# Altium schematic sheet CasinoLEDScheme.SchDoc
size B
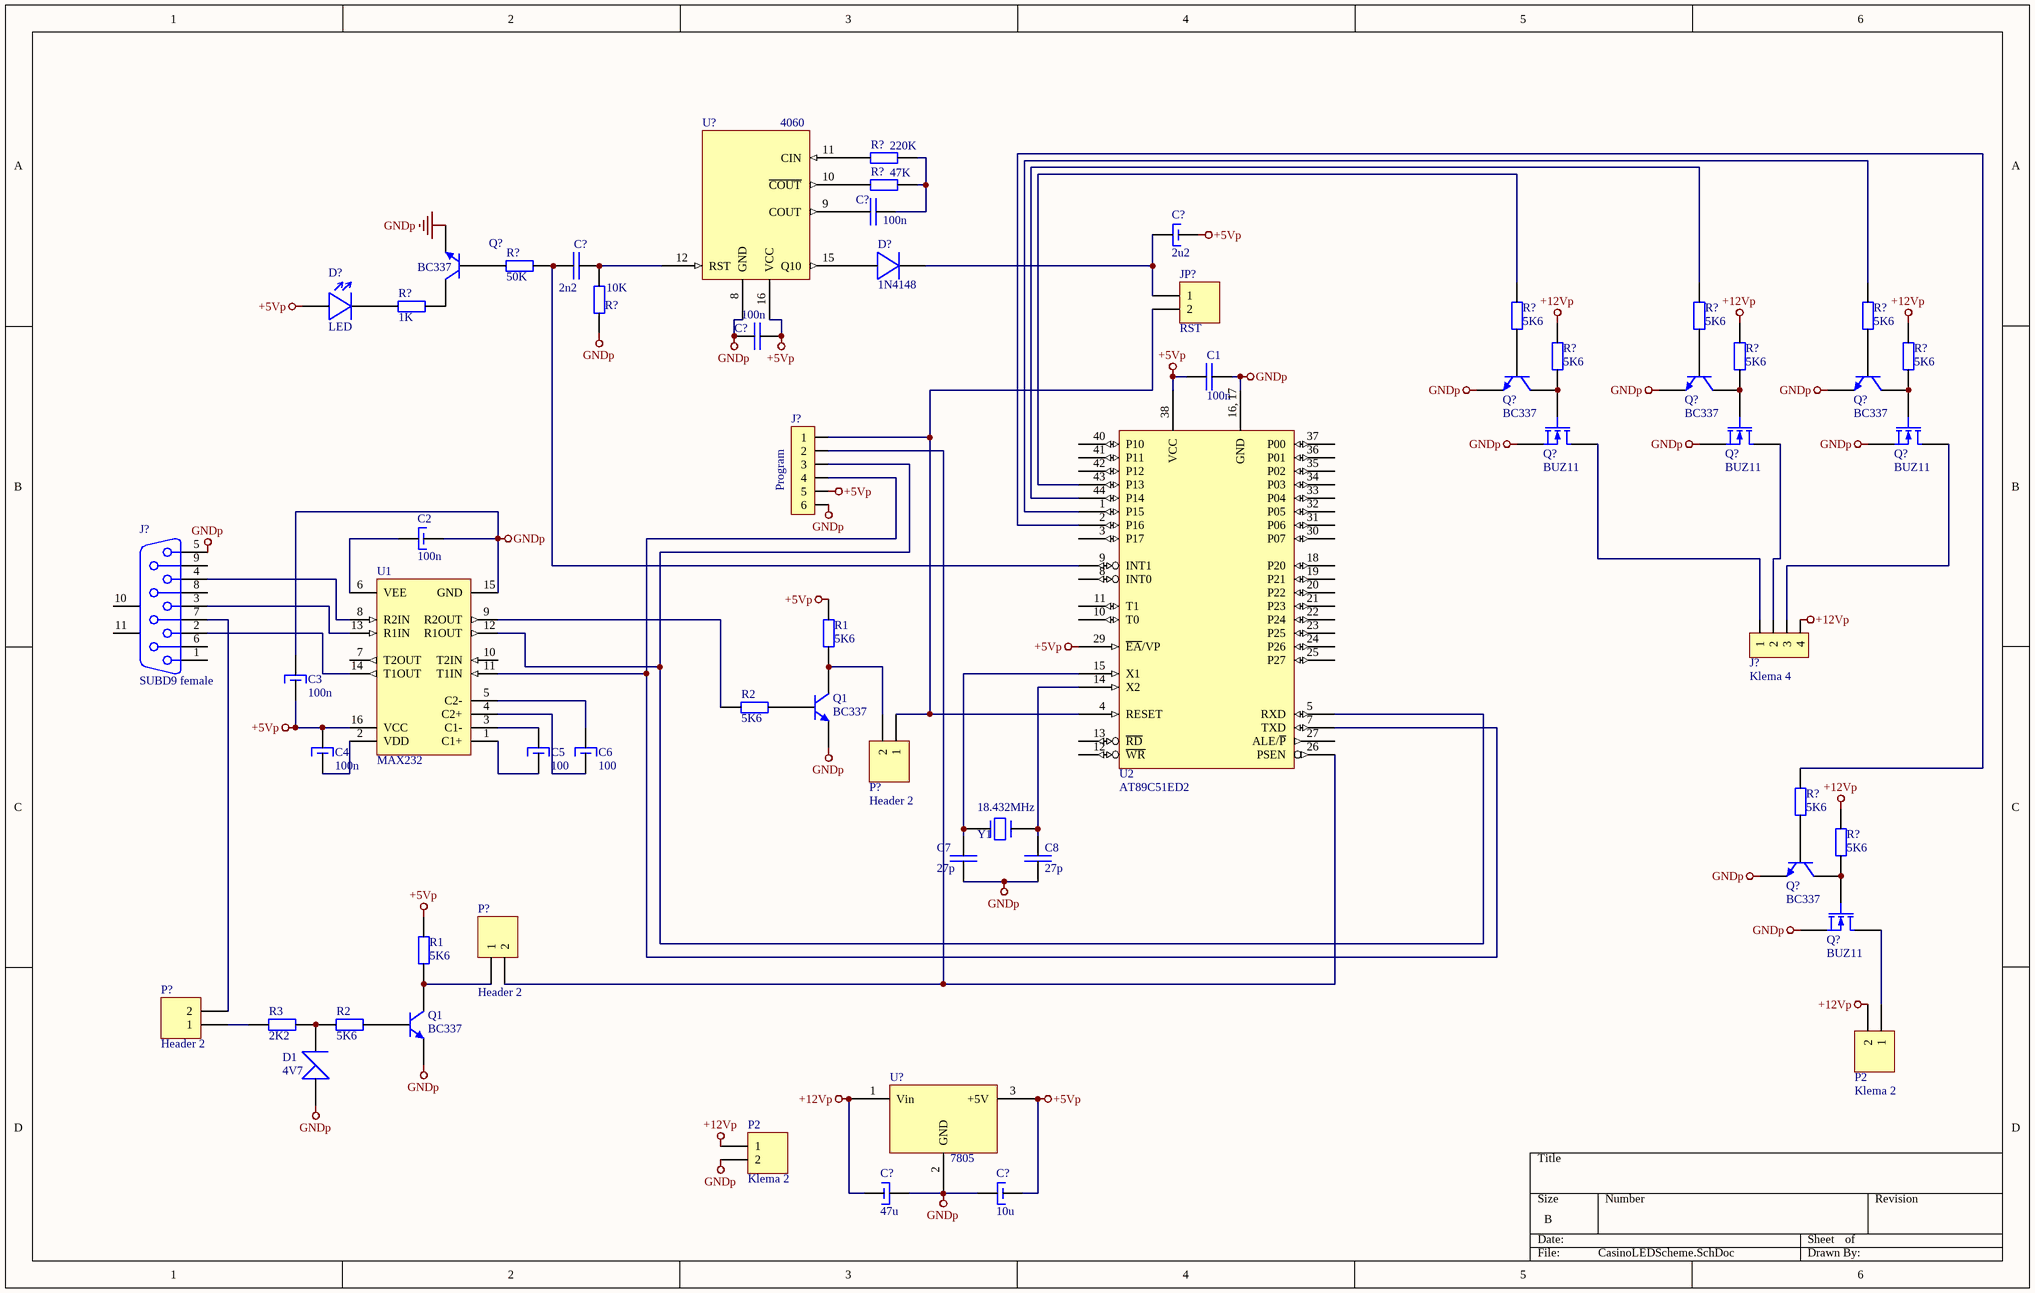
[diagram p0: CasinoLEDScheme.SchDoc]

## Parts
(Parts that share a designator on the sheet are numbered #1, #2 ... from top to bottom, then left to right.)
C1  100n  [SMD0805]
C2  value 100n  [SMD0805]  (hidden comment: Capacitor)
C3  value 100n  [SMD0805]  (hidden comment: Capacitor)
C4  value 100n  [SMD0805]  (hidden comment: Capacitor)
C5  value 100  [SMD0805]  (hidden comment: Capacitor)
C6  value 100  [SMD0805]  (hidden comment: Capacitor)
C7  27p  [SMD0805]
C8  27p  [SMD0805]
C?#1  100n  [SMD0805]
C?#2  2u2  [caseB]
C?#3  2n2  [SMD0805]
C?#4  100n  [SMD0805]
C?#5  47u  [Capacitor 10mikro]
C?#6  10u  [Capacitor 10mikro]
D1  4V7  [Minimelf]
D?#1  1N4148  [Minimelf]
D?#2  LED  [LED]
J?#1  Program  [Konektor6]
J?#2  SUBD9 female  [DSUB9F]
J?#3  Klema 4  [Conn4 3.96mm]
JP?  RST  [HDR1X2]
P2#1  Klema 2  [Pdnozje za napajanje]
P2#2  Klema 2  [Pdnozje za napajanje]
P?#1  Header 2  [HDR1X2]
P?#2  Header 2  [HDR1X2]
P?#3  Header 2  [HDR1X2]
Q1#1  BC337  [SOT-23]
Q1#2  BC337  [SOT-23]
Q?#1  BC337  [SOT-23]
Q?#2  BC337  [SOT-23]
Q?#3  BC337  [SOT-23]
Q?#4  BC337  [SOT-23]
Q?#5  BUZ11  [E3]
Q?#6  BUZ11  [E3]
Q?#7  BUZ11  [E3]
Q?#8  BC337  [SOT-23]
Q?#9  BUZ11  [E3]
R1#1  5K6  [SMD0805]
R1#2  5K6  [SMD0805]
R2#1  5K6  [SMD0805]
R2#2  5K6  [SMD0805]
R3  2K2  [SMD0805]
R?#1  220K  [SMD0805]
R?#2  47K  [SMD0805]
R?#3  50K  [SMD0805]
R?#4  10K  [SMD0805]
R?#5  1K  [SMD0805]
R?#6  5K6  [SMD0805]
R?#7  5K6  [SMD0805]
R?#8  5K6  [SMD0805]
R?#9  5K6  [SMD0805]
R?#10  5K6  [SMD0805]
R?#11  5K6  [SMD0805]
R?#12  5K6  [SMD0805]
R?#13  5K6  [SMD0805]
U1  MAX232  [NSO16_M]
U2  AT89C51ED2  [VQFP44-dz]
U?#1  4060  [SOT109-1]
U?#2  7805  [D-PAK16]
Y1  18.432MHz  [HC49/4H_SMX]

## Nets
+5Vp: C1.1 C3.1 C4.2 C?#2.1 C?#4.2 C?#6.1 D?#2.1 J?#1.5 R1#1.2 R1#2.2 U1.16(VCC) U2.29(~{EA}/VP) U2.38(VCC) U?#1.16(VCC) U?#2.3(+5V)
+12Vp: C?#5.1 J?#3.4 P2#1.2 P2#2.1 R?#9.2 R?#10.2 R?#11.2 R?#13.2 U?#2.1(Vin)
GNDp: C1.2 C2.1 C3.2 C7.1 C8.1 C?#4.1 C?#5.2 C?#6.2 D1.1 J?#1.6 J?#2.5 P2#2.2 Q1#1.2(E) Q1#2.2(E) Q?#1.2(E) Q?#2.2(E) Q?#3.2(E) Q?#4.2(E) Q?#5.3(S) Q?#6.3(S) Q?#7.3(S) Q?#8.2(E) Q?#9.3(S) R?#4.1 U1.15(GND) U2.16,_17(GND) U2.17(GND) U?#1.8(GND) U?#2.2(GND)
NetC2_2: C2.2 U1.6(VEE)
NetC4_1: C4.1 U1.2(VDD)
NetC5_1: C5.1 U1.1(C1+)
NetC5_2: C5.2 U1.3(C1-)
NetC6_1: C6.1 U1.4(C2+)
NetC6_2: C6.2 U1.5(C2-)
NetC7_2: C7.2 U2.15(X1) Y1.2
NetC8_2: C8.2 U2.14(X2) Y1.1
NetC?#1_1: C?#1.1 U?#1.9(COUT)
NetC?#1_2: C?#1.2 R?#1.2 R?#2.2
NetC?#2_2: C?#2.2 D?#1.2 JP?.1
NetC?#3_1: C?#3.1 R?#3.1 U2.9(INT1)
NetC?#3_2: C?#3.2 R?#4.2 U?#1.12(RST)
NetD1_2: D1.2 R2#2.2 R3.1
NetD?#1_1: D?#1.1 U?#1.15(Q10)
NetD?#2_2: D?#2.2 R?#5.1
NetJ?#1_1: J?#1.1 JP?.2 P?#1.1 U2.4(RESET)
NetJ?#1_2: J?#1.2 P?#2.2 U2.26(PSEN)
NetJ?#1_3: J?#1.3 U1.12(R1OUT) U2.5(RXD)
NetJ?#1_4: J?#1.4 U1.11(T1IN) U2.7(TXD)
NetJ?#2_2: J?#2.2 U1.14(T1OUT)
NetJ?#2_3: J?#2.3 U1.13(R1IN)
NetJ?#2_4: J?#2.4 U1.8(R2IN)
NetJ?#2_7: J?#2.7 P?#3.2
NetJ?#3_1: J?#3.1 Q?#5.1(D)
NetJ?#3_2: J?#3.2 Q?#6.1(D)
NetJ?#3_3: J?#3.3 Q?#7.1(D)
NetP2#1_1: P2#1.1 Q?#9.1(D)
NetP?#1_2: P?#1.2 Q1#1.3(C) R1#1.1
NetP?#2_1: P?#2.1 Q1#2.3(C) R1#2.1
NetP?#3_1: P?#3.1 R3.2
NetQ1#1_1: Q1#1.1(B) R2#1.1
NetQ1#2_1: Q1#2.1(B) R2#2.1
NetQ?#1_1: Q?#1.1(B) R?#3.2
NetQ?#1_3: Q?#1.3(C) R?#5.2
NetQ?#2_1: Q?#2.1(B) R?#6.1
NetQ?#2_3: Q?#2.3(C) Q?#5.2(G) R?#9.1
NetQ?#3_1: Q?#3.1(B) R?#7.1
NetQ?#3_3: Q?#3.3(C) Q?#6.2(G) R?#10.1
NetQ?#4_1: Q?#4.1(B) R?#8.1
NetQ?#4_3: Q?#4.3(C) Q?#7.2(G) R?#11.1
NetQ?#8_1: Q?#8.1(B) R?#12.1
NetQ?#8_3: Q?#8.3(C) Q?#9.2(G) R?#13.1
NetR2#1_2: R2#1.2 U1.9(R2OUT)
NetR?#1_1: R?#1.1 U?#1.11(CIN)
NetR?#2_1: R?#2.1 U?#1.10(~{COUT})
NetR?#6_2: R?#6.2 U2.43(P13)
NetR?#7_2: R?#7.2 U2.44(P14)
NetR?#8_2: R?#8.2 U2.1(P15)
NetR?#12_2: R?#12.2 U2.2(P16)

Not connected (* = marked no-connect by the designer): J?#2 1 6 8 9 10(MH1) 11(MH2); U1 7(T2OUT) 10(T2IN); U2 3(P17) 8(INT0) 10(T0) 11(T1) 12(~{WR}) 13(~{RD}) 18(P20) 19(P21) 20(P22) 21(P23) 22(P24) 23(P25) 24(P26) 25(P27) 27(ALE/~{P}) 30(P07) 31(P06) 32(P05) 33(P04) 34(P03) 35(P02) 36(P01) 37(P00) 40(P10) 41(P11) 42(P12); U?#1 1(Q12) 2(Q13) 3(Q14) 4(Q6) 5(Q5) 6(Q7) 7(Q4) 13(Q9) 14(Q8)

## Library data of the parts
C1 C7 C8 C?#1 C?#3 C?#4 = Capacitor
C2-C6 C?#2 = Capacitor 4mikro7
C?#5 C?#6 = Capacitor 10mikro
D1 = Diode Zener
D?#1 = Diode
J?#1 = Konektor6
J?#2 = SUBD9 female: Receptacle Assembly, 9 Position, Right Angle; Package Information: Latest Revision: O; Positions: 9; Published: 15-Jun-2001; Revision: 17-Jul-2002: Re-released for DXP Platform.; Datasheet: (1-Sep-1999); Package Reference: 788750; Publisher: Altium Limited; Orientation: Right Angle; Gender: Receptacle
J?#3 = Conn4 3.96mm
JP? P2#1 P2#2 P?#1-P?#3 = Header 2: Header, 2-Pin; Publisher: Altium Limited
  JP?: Revision: 17-Jul-2002: Re-released for DXP Platform.
  P2#1 P2#2 P?#1-P?#3: LatestRevisionDate: 17-Jul-2002; LatestRevisionNote: Re-released for DXP Platform.
Q1#1 Q1#2 Q?#1-Q?#4 Q?#8 = BC817
Q?#5-Q?#7 Q?#9 = MOSFET-N: N-Channel MOSFET; PackageDocument: 1995/1996; Published: 8-Jun-2000; LatestRevisionDate: 17-Jul-2002; LatestRevisionNote: Re-released for DXP Platform.; PackageReference: E3; Publisher: Altium Limited
R1#1 R1#2 R2#1 R2#2 R3 R?#1 R?#2 R?#4 R?#6-R?#13 = Resistor 0.25W
R?#3 R?#5 = Resistor 1/8W
U1 = MAX232ACSE: +5V Powered, Multi-Channel RS-232 Driver/Receiver; Code - JEDEC: MS-012-AC; Code - IPC: SO16; Published: 16-Jan-2001; Revision: 17-Jul-2002: Re-released for DXP Platform.; Package Reference: NSO16; Publisher: Altium Limited
U2 = AT89S52
Y1 = Kristal mali